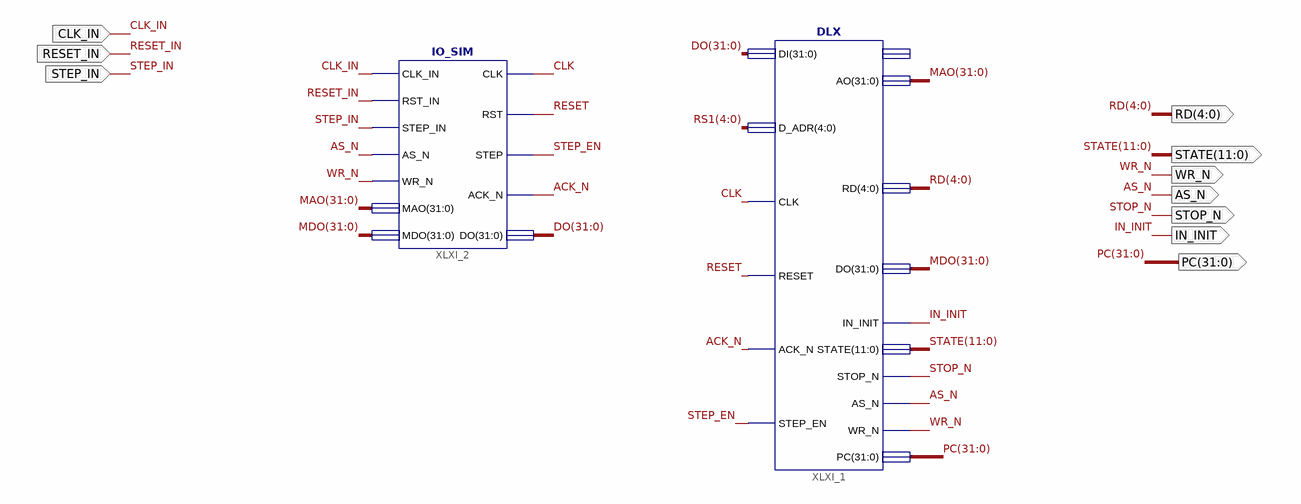
[diagram p0: schematic sheet 1]
// Xilinx ISE schematic IO_SIM_DLX.sch (spartan6) as structural Verilog: 2 symbols, 10 ports
module IO_SIM_DLX (
  input  STEP_IN,
  input  RESET_IN,
  input  CLK_IN,
  output AS_N,
  output [4:0] RD,
  output IN_INIT,
  output [11:0] STATE,
  output STOP_N,
  output WR_N,
  output [31:0] PC
);

  wire ACK_N, CLK, RESET, STEP_EN;
  wire [4:0] RS1;
  wire [31:0] DO, MAO, MDO;

  DLX XLXI_1 (
    .DI(DO), .D_ADR(RS1), .CLK(CLK), .RESET(RESET), .ACK_N(ACK_N), .STEP_EN(STEP_EN), .AO(MAO), .RD(RD),
    .DO(MDO), .IN_INIT(IN_INIT), .STATE(STATE), .STOP_N(STOP_N), .AS_N(AS_N), .WR_N(WR_N), .PC(PC));  // open: DO_D
  IO_SIM XLXI_2 (
    .CLK_IN(CLK_IN), .RST_IN(RESET_IN), .STEP_IN(STEP_IN), .AS_N(AS_N), .WR_N(WR_N), .MAO(MAO), .MDO(MDO),
    .CLK(CLK), .RST(RESET), .STEP(STEP_EN), .ACK_N(ACK_N), .DO(DO));
endmodule
